# Altium project RF Main Board.PrjPcb
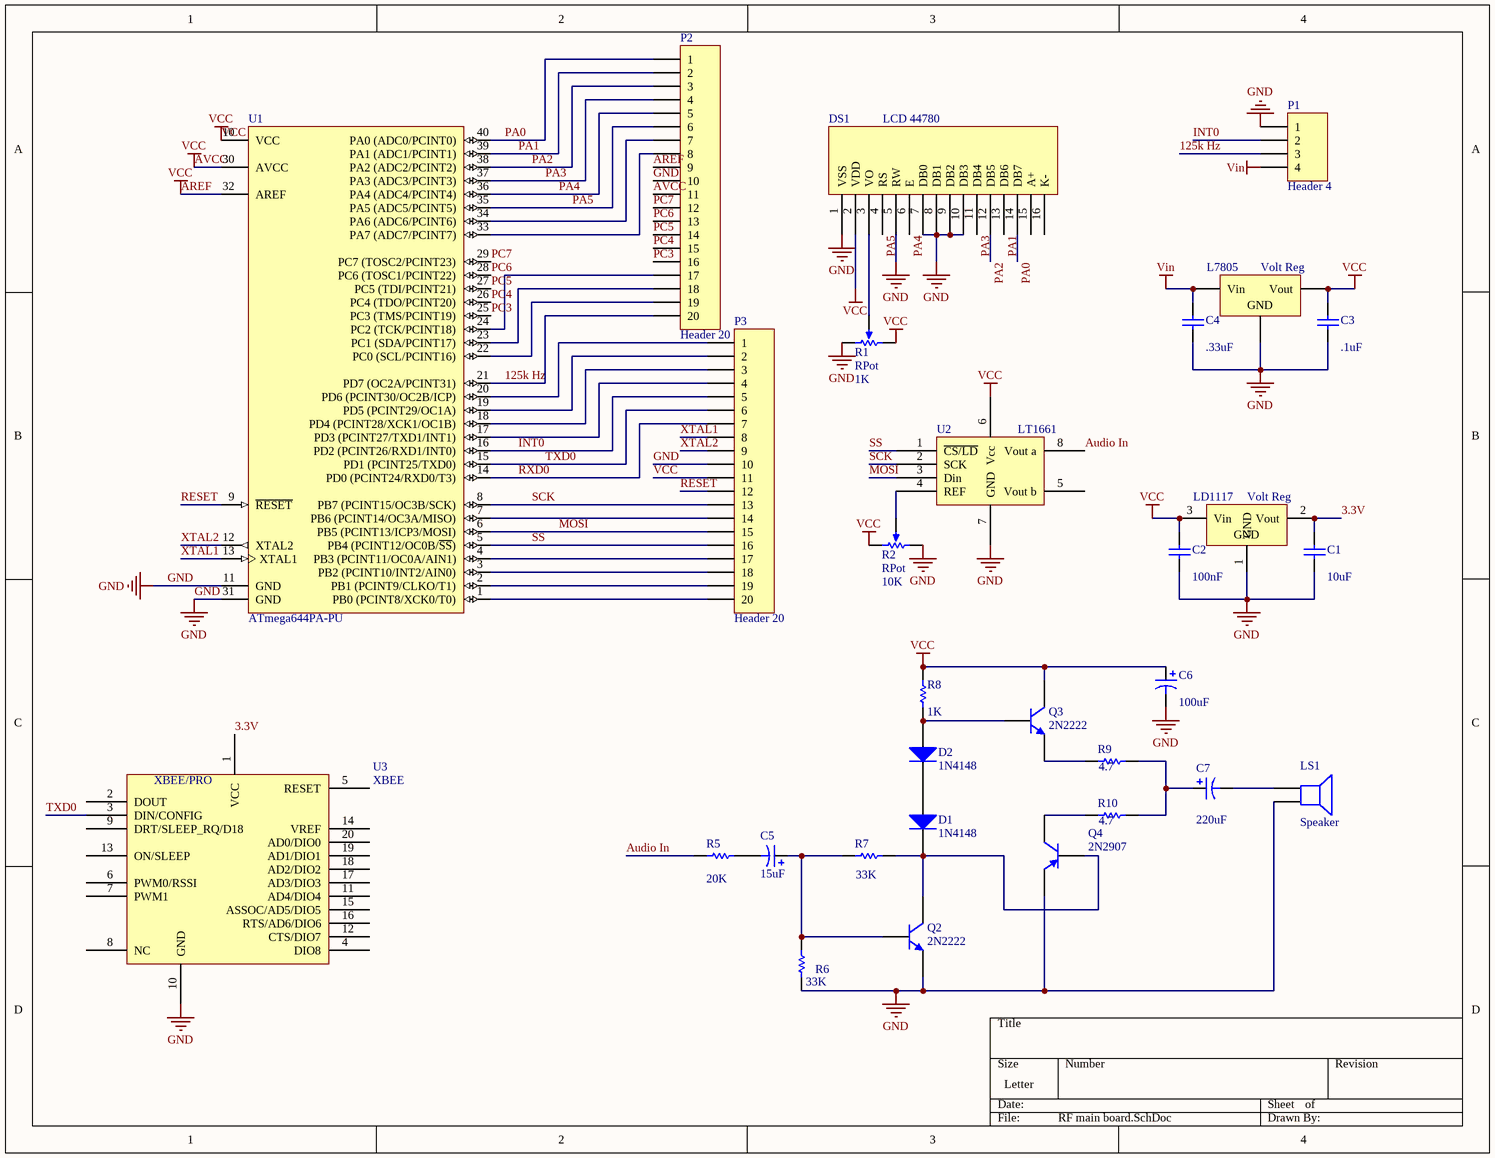
[diagram p0: RF main board.SchDoc]
1 sheet, 30 parts. Net scope: global (net labels, ports and power ports of the same name join across sheets).
Board file: RF Main Board.PcbDoc

## Sheet RF main board.SchDoc
size Letter

### Parts
C1  value 10uF  [RAD-0.3]
C2  value 100nF  [RAD-0.3]  (hidden comment: Cap)
C3  value .1uF  [RAD-0.3]  (hidden comment: Cap)
C4  value .33uF  [RAD-0.3]  (hidden comment: Cap)
C5  value 15uF  [CAPR5-4X5]  (hidden comment: Cap Pol1)
C6  value 100uF  [CAPR5-4X5]  (hidden comment: Cap Pol1)
C7  value 220uF  [CAPR5-4X5]  (hidden comment: Cap Pol1)
D1  1N4148  [DO-35]
D2  1N4148  [DO-35]
DS1  LCD 44780  [OLED 16x2]
L7805  Volt Reg  [HDR1X3]
LD1117  Volt Reg  [HDR1X3]
LS1  Speaker  [PIN2]
P1  Header 4  [HDR1X4]
P2  Header 20  [HDR1X20]
P3  Header 20  [HDR1X20]
Q2  2N2222  [TO-226-AA]
Q3  2N2222  [TO-226-AA]
Q4  2N2907  [TO-226-AA]
R1  RPot  value 1K  [VR5]
R2  RPot  value 10K  [VR5]
R5  value 20K  [AXIAL-0.3]  (hidden comment: Res1)
R6  value 33K  [AXIAL-0.3]  (hidden comment: Res1)
R7  value 33K  [AXIAL-0.3]  (hidden comment: Res1)
R8  value 1K  [AXIAL-0.3]  (hidden comment: Res1)
R9  value 4.7  [AXIAL-0.3]  (hidden comment: Res1)
R10  value 4.7  [AXIAL-0.3]
U1  ATmega644PA-PU  [40P6]
U2  LT1661  [DIP-8]
U3  XBEE  [XBEE/PRO]

### Nets
AREF: C2.2 C3.2 C6.1 DS1.2(VDD) L7805.3(Vout) LD1117.3(Vin) P2.9 P2.11 P3.11 Q3.1(C) R1.1(TOP) R2.2(BOT) R8.2 U1.10(VCC) U1.30(AVCC) U1.32(AREF) U2.6(Vcc)  [also labelled AVCC, VCC]
GND: C1.1 C2.1 C3.1 C4.1 C6.2 DS1.1(VSS) DS1.5(RW) DS1.7(DB0) DS1.8(DB1) DS1.9(DB2) DS1.10(DB3) L7805.2(GND) LD1117.1(GND) LS1.2 P1.1 P2.10 P3.10 Q2.3(E) Q4.3(E) R1.2(BOT) R2.1(TOP) R6.2 U1.11(GND) U1.31(GND) U2.7(GND) U3.10(GND)
Vin: C4.2 L7805.1(Vin) P1.4
3.3V: C1.2 LD1117.2(Vout) U3.1(VCC)
125k Hz: P1.3 P2.20 U1.21(PD7_(OC2A/PCINT31))
Audio In: R5.1 U2.8(Vout_a)
INT0: P1.2 P3.5 U1.16(PD2_(PCINT26/RXD1/INT0))
MOSI: P3.15 U1.6(PB5_(PCINT13/ICP3/MOSI)) U2.3(Din)
PA0: DS1.14(DB7) P2.1 U1.40(PA0_(ADC0/PCINT0))
PA1: DS1.13(DB6) P2.2 U1.39(PA1_(ADC1/PCINT1))
PA2: DS1.12(DB5) P2.3 U1.38(PA2_(ADC2/PCINT2))
PA3: DS1.11(DB4) P2.4 U1.37(PA3_(ADC3/PCINT3))
PA4: DS1.6(E) P2.5 U1.36(PA4_(ADC4/PCINT4))
PA5: DS1.4(RS) P2.6 U1.35(PA5_(ADC5/PCINT5))
PC3: P2.16 U1.25(PC3_(TMS/PCINT19))
PC4: P2.15 U1.26(PC4_(TDO/PCINT20))
PC5: P2.14 U1.27(PC5_(TDI/PCINT21))
PC6: P2.13 U1.28(PC6_(TOSC1/PCINT22))
PC7: P2.12 U1.29(PC7_(TOSC2/PCINT23))
RESET: P3.12 U1.9(~{RESET})
RXD0: P3.7 U1.14(PD0_(PCINT24/RXD0/T3))
SCK: P3.13 U1.8(PB7_(PCINT15/OC3B/SCK)) U2.2(SCK)
SS: P3.16 U1.5(PB4_(PCINT12/OC0B/~{SS})) U2.1(~{CS/LD})
TXD0: P3.6 U1.15(PD1_(PCINT25/TXD0)) U3.3(DIN/CONFIG)
XTAL1: P3.8 U1.13(XTAL1)
XTAL2: P3.9 U1.12(XTAL2)
NetC5_1: C5.1 Q2.2(B) R6.1 R7.2
NetC5_2: C5.2 R5.2
NetC7_1: C7.1 R9.2 R10.2
NetC7_2: C7.2 LS1.1
NetD1_1: D1.1(A) D2.2(K)
NetD1_2: D1.2(K) Q2.1(C) Q4.2(B) R7.1
NetD2_1: D2.1(A) Q3.2(B) R8.1
NetDS1_3: DS1.3(VO) R1.3(TAP)
NetP2_7: P2.7 U1.34(PA6_(ADC6/PCINT6))
NetP2_8: P2.8 U1.33(PA7_(ADC7/PCINT7))
NetP2_17: P2.17 U1.24(PC2_(TCK/PCINT18))
NetP2_18: P2.18 U1.23(PC1_(SDA/PCINT17))
NetP2_19: P2.19 U1.22(PC0_(SCL/PCINT16))
NetP3_1: P3.1 U1.20(PD6_(PCINT30/OC2B/ICP))
NetP3_2: P3.2 U1.19(PD5_(PCINT29/OC1A))
NetP3_3: P3.3 U1.18(PD4_(PCINT28/XCK1/OC1B))
NetP3_4: P3.4 U1.17(PD3_(PCINT27/TXD1/INT1))
NetP3_14: P3.14 U1.7(PB6_(PCINT14/OC3A/MISO))
NetP3_17: P3.17 U1.4(PB3_(PCINT11/OC0A/AIN1))
NetP3_18: P3.18 U1.3(PB2_(PCINT10/INT2/AIN0))
NetP3_19: P3.19 U1.2(PB1_(PCINT9/CLKO/T1))
NetP3_20: P3.20 U1.1(PB0_(PCINT8/XCK0/T0))
NetQ3_3: Q3.3(E) R9.1
NetQ4_1: Q4.1(C) R10.1
NetR2_3: R2.3(TAP) U2.4(REF)

Not connected (* = marked no-connect by the designer): DS1 15(A+) 16(K-); U2 5(Vout_b); U3 2(DOUT) 4(DIO8) 5(RESET) 6(PWM0/RSSI) 7(PWM1) 8(NC) 9(DRT/SLEEP_RQ/D18) 11(AD4/DIO4) 12(CTS/DIO7) 13(ON/SLEEP) 14(VREF) 15(ASSOC/AD5/DIO5) 16(RTS/AD6/DIO6) 17(AD3/DIO3) 18(AD2/DIO2) 19(AD1/DIO1) 20(AD0/DIO0)

### Notes on the sheet
- (in symbol XBEE) XBEE/PRO

### Library data of the parts
C1-C4 = Cap: Capacitor; Published: 8-Jun-2000; LatestRevisionDate: 17-Jul-2002; LatestRevisionNote: Re-released for DXP Platform.; PackageReference: RAD-0.3; Publisher: Altium Limited; PackageDescription: Radial Cap, Thru-Hole; 2 Leads; 0.3 in Pin Spacing
C5-C7 = Cap Pol1: Polarized Capacitor (Radial); Published: 8-Jun-2000; LatestRevisionDate: 17-Jul-2002; LatestRevisionNote: Re-released for DXP Platform.; PackageReference: RB7.6-15; Publisher: Altium Limited; PackageDescription: Polarized Capacitor (Radial); 2 Leads
D1 D2 = Diode 1N4148: High Conductance Fast Diode; Published: 8-Jun-2000; LatestRevisionDate: 17-Jul-2002; LatestRevisionNote: Re-released for DXP Platform.; DatasheetVersion: 1997; PackageReference: DO-35; Publisher: Altium Limited; PackageDescription: Diode, Axial; Body 3.8 x 1.9 mm (LxDia. max), Lead Dia. 0.53 mm (max); Code_JEDEC: DO-204-AH; ComponentLink1Description: Manufacturer Link; ComponentLink1URL: http://www.fairchildsemi.com/; ComponentLink2Description: Datasheet; ComponentLink2URL: http://www.fairchildsemi.com/ds/1N%2F1N4148.pdf
L7805 LD1117 = Volt Reg: Voltage Regulator; Published: 24-Mar-1999; LatestRevisionDate: 29-May-2009; LatestRevisionNote: IPC-7351 Footprint Added.; PackageReference: D2PAK; Publisher: Altium Limited; PackageDescription: 3-Pin Transistor Outline Package 2.54 mm Pitch, 15.1 mm Lead Span
LS1 = Speaker: Loudspeaker; Published: 24-Mar-1999; LatestRevisionDate: 17-Jul-2002; LatestRevisionNote: Re-released for DXP Platform.; PackageReference: PIN2; Publisher: Altium Limited
P1 = Header 4: Header, 4-Pin; LatestRevisionDate: 17-Jul-2002; LatestRevisionNote: Re-released for DXP Platform.; Publisher: Altium Limited
P2 P3 = Header 20: Header, 20-Pin; LatestRevisionDate: 17-Jul-2002; LatestRevisionNote: Re-released for DXP Platform.; Publisher: Altium Limited
Q2 Q3 = NPN: NPN Bipolar Transistor; Published: 8-Jun-2000; LatestRevisionDate: 17-Jul-2002; LatestRevisionNote: Re-released for DXP Platform.; PackageReference: TO-226-AA; Publisher: Altium Limited; PackageDescription: TO, Flat Index; 3 In-Line, Axial Leads; Body Dia. 4.8mm; Leads 0.55 x 0.51 mm (max); Code_JEDEC: TO-226-AA
Q4 = PNP: PNP Bipolar Transistor; Published: 8-Jun-2000; LatestRevisionDate: 29-May-2009; LatestRevisionNote: IPC-7351 Footprint Added.; PackageVersion: Aug-1999; PackageReference: SOT-23B; Publisher: Altium Limited; PackageDescription: 3-Pin SOT-23 Package 0.95 mm Pitch, 2.4 mm Lead Span
R1 R2 = RPot: Potentiometer; Sim Note: Enter the Resistance value and the set point into parameter fields.; Set Position: 0.5; Published: 8-Jun-2000; LatestRevisionDate: 17-Jul-2002; LatestRevisionNote: Re-released for DXP Platform.; PackageReference: VR5; Publisher: Altium Limited; PackageDescription: Variable Resistor, Thru-Hole; 3 Leads
R5-R10 = Res1: Resistor; Published: 8-Jun-2000; LatestRevisionDate: 17-Jul-2002; LatestRevisionNote: Re-released for DXP Platform.; PackageReference: AXIAL-0.3; Publisher: Altium Limited; PackageDescription: Axial Device, Thru-Hole; 2 Leads; 0.3 in Pin Spacing
U1 = ATmega644PA-PU: 8-bit AVR Microcontroller, 64KB Flash, 2KB EEPROM, 4KB SRAM, 40-pin PDIP, Industrial Grade (-40°C to 85°C); DatasheetVersion: revC, Jun-2011; PackageVersion: revB, Sep-2001; PackageReference: 40P6; PackageDescription: 40-lead (0.600"/15.24mm Wide) Plastic Dual Inline Package (PDIP); Code_JEDEC: MS-011-AC; ComponentLink1Description: Manufacturer URL; ComponentLink1URL: http://www.atmel.com/; ComponentLink2Description: ATmega164A/164PA/324A/324PA/644A/644PA/1284/1284P Datasheet; ComponentLink2URL: http://www.atmel.com/dyn/resources/prod_documents/doc8272.pdf; ComponentLink3Description: ATmega164A/164PA/324A/324PA/644A/644PA/1284/1284P Summary; ComponentLink3URL: http://www.atmel.com/dyn/resources/prod_documents/8272S.pdf